# EAGLE design schematicv1.0 (EAGLE 9.6.2)
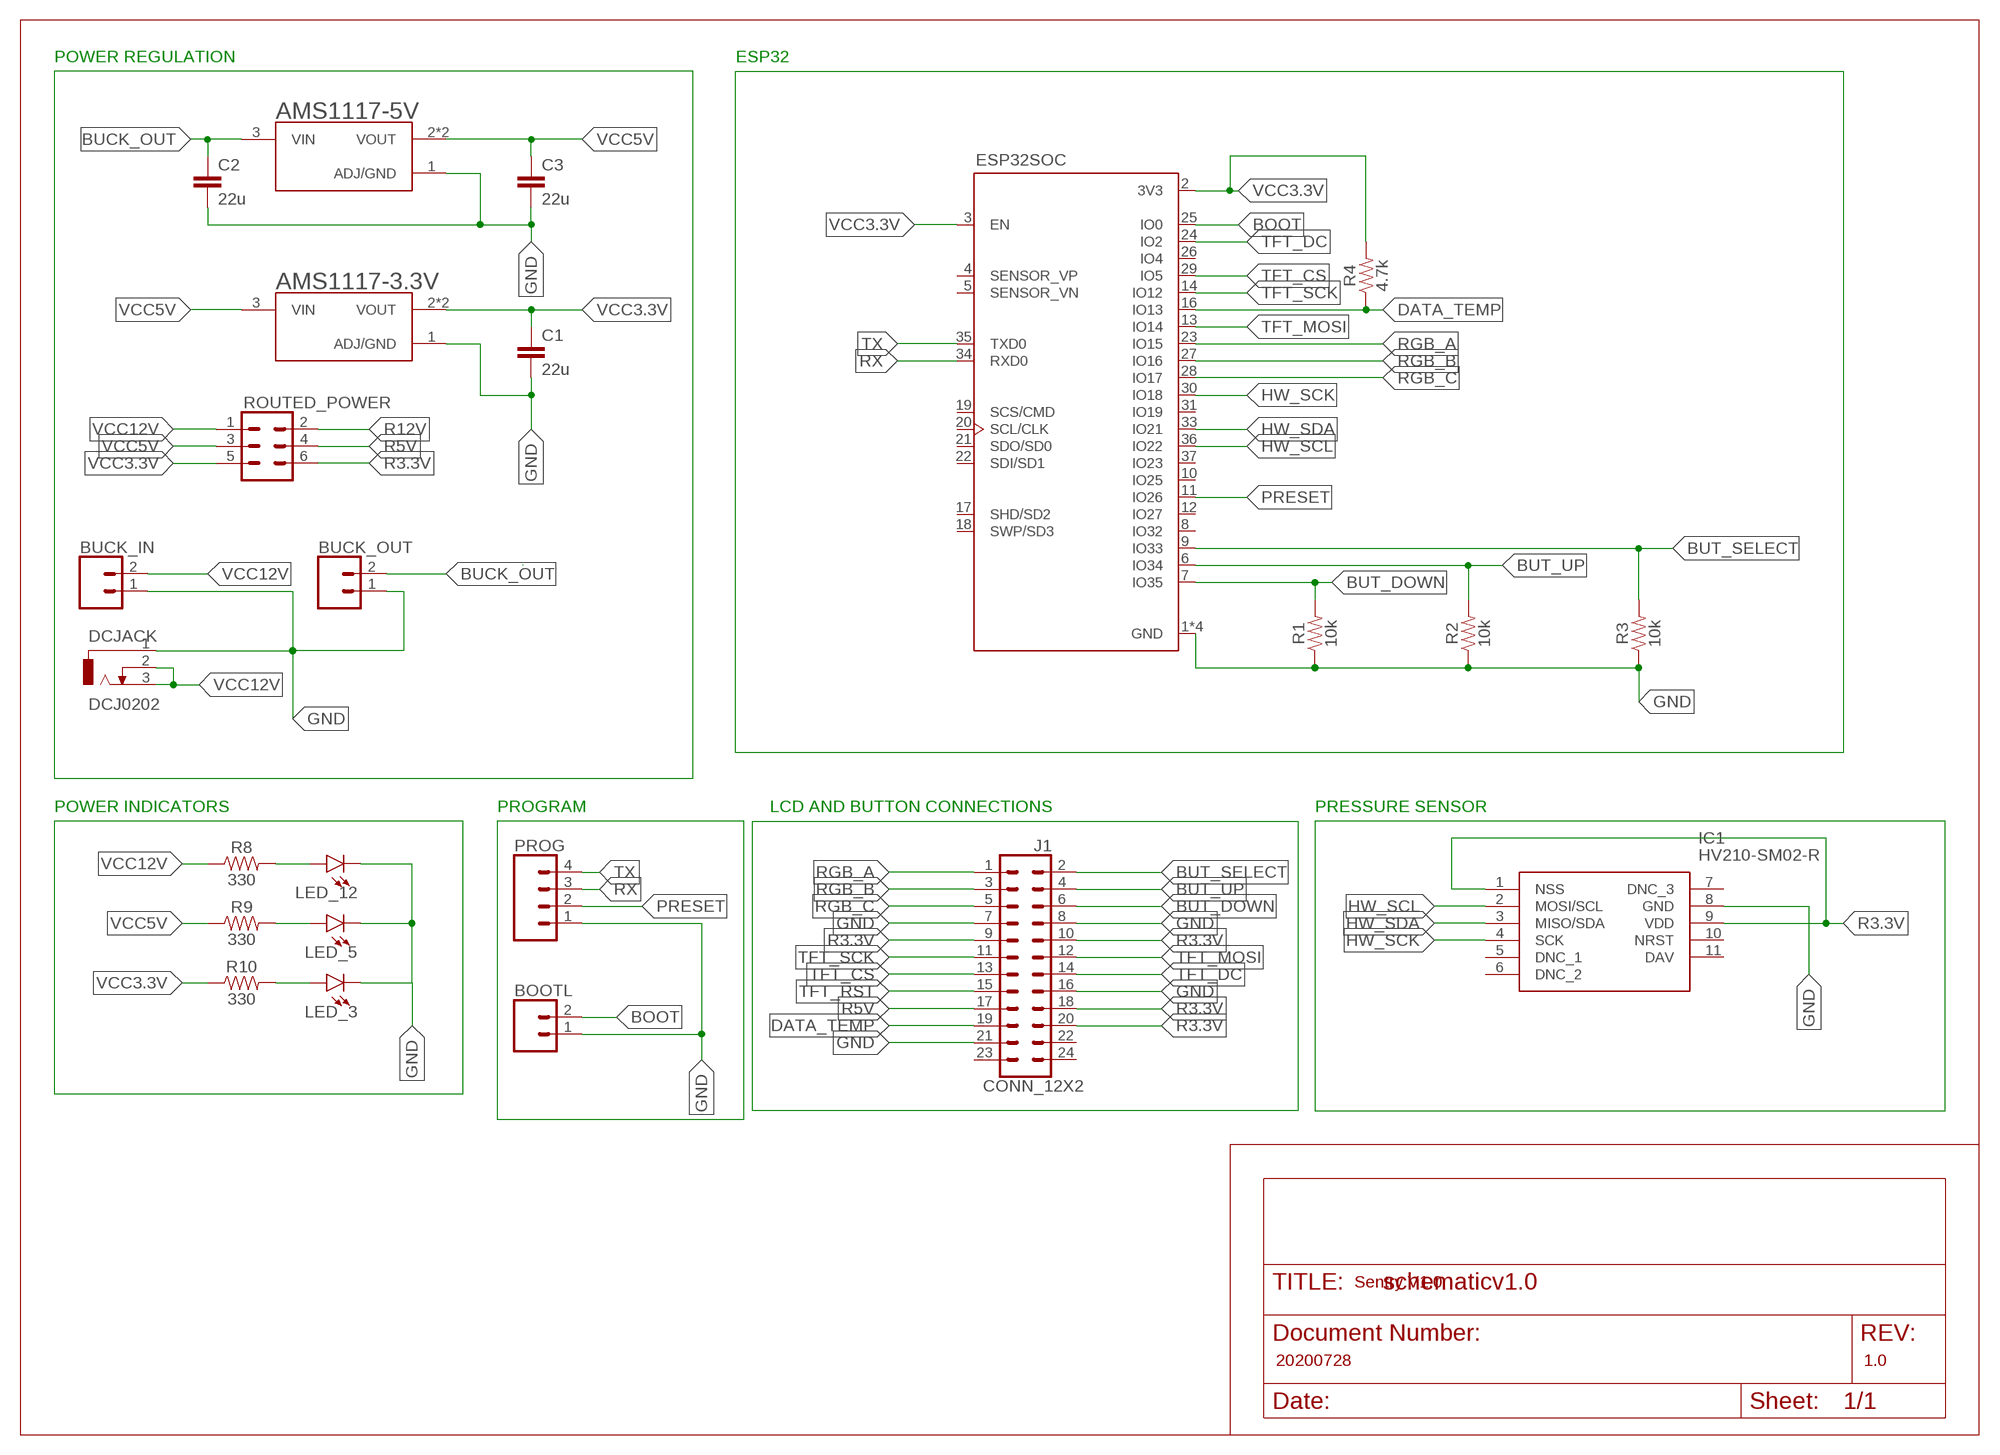
[diagram p0: schematic, sheet 1]

## Parts
AMS1117-3.3V  AMS1117  [SOT229P700X180-4N]
AMS1117-5V  AMS1117  [SOT229P700X180-4N]
BOOTL  CONN_02  [1X02]
BUCK_IN  CONN_02  [1X02]
BUCK_OUT  CONN_02  [1X02]
C1  22u  CAP-1206  [1206]
C2  22u  CAP-1206  [1206]
C3  22u  CAP-1206  [1206]
DCJACK  DCJ0202  [DCJ0202]
ESP32SOC  ESP32-WROOM-32D  [MODULE_ESP32-WROOM-32D]
IC1  HV210-SM02-R  [HV210SM02R]
J1  CONN_12X2  [2X12]
LED_3  LED1206  [LED-1206]
LED_5  LED1206  [LED-1206]
LED_12  LED1206  [LED-1206]
PROG  CONN_04PTH  [1X04]
R1  10k  RESISTOR1206  [1206]
R2  10k  RESISTOR1206  [1206]
R3  10k  RESISTOR1206  [1206]
R4  4.7k  RESISTOR1206  [1206]
R8  330  RESISTOR1206  [1206]
R9  330  RESISTOR1206  [1206]
R10  330  RESISTOR1206  [1206]
ROUTED_POWER  CONN_03X2FEMALE  [2X3]

## Nets
BOOT: BOOTL.2 ESP32SOC.25(IO0)
BUCK_OUT: AMS1117-5V.3(VIN) BUCK_OUT.2 C2.1
BUT_DOWN: ESP32SOC.7(IO35) J1.6 R1.2
BUT_SELECT: ESP32SOC.9(IO33) J1.2 R3.2
BUT_UP: ESP32SOC.6(IO34) J1.4 R2.2
DATA_TEMP: ESP32SOC.16(IO13) J1.19 R4.1
GND: AMS1117-3.3V.1(ADJ/GND) AMS1117-5V.1(ADJ/GND) BOOTL.1 BUCK_IN.1 BUCK_OUT.1 C1.2 C2.2 C3.2 DCJACK.1 ESP32SOC.1(GND) ESP32SOC.15(GND) ESP32SOC.38(GND) ESP32SOC.39(GND) IC1.8(GND) J1.7 J1.8 J1.16 J1.21 LED_3.C LED_5.C LED_12.C PROG.1 R1.1 R2.1 R3.1
HW_SCK: ESP32SOC.30(IO18) IC1.4(SCK)
HW_SCL: ESP32SOC.36(IO22) IC1.2(MOSI/SCL)
HW_SDA: ESP32SOC.33(IO21) IC1.3(MISO/SDA)
N$1: LED_12.A R8.2
N$2: LED_5.A R9.2
N$3: LED_3.A R10.2
PRESET: ESP32SOC.11(IO26) PROG.2
R3.3V: IC1.1(NSS) IC1.9(VDD) J1.9 J1.10 J1.18 J1.20 ROUTED_POWER.6
R5V: J1.17 ROUTED_POWER.4
R12V: ROUTED_POWER.2
RGB_A: ESP32SOC.23(IO15) J1.1
RGB_B: ESP32SOC.27(IO16) J1.3
RGB_C: ESP32SOC.28(IO17) J1.5
RX: ESP32SOC.34(RXD0) PROG.3
TFT_CS: ESP32SOC.29(IO5) J1.13
TFT_DC: ESP32SOC.24(IO2) J1.14
TFT_MOSI: ESP32SOC.13(IO14) J1.12
TFT_RST: J1.15
TFT_SCK: ESP32SOC.14(IO12) J1.11
TX: ESP32SOC.35(TXD0) PROG.4
VCC3.3V: AMS1117-3.3V.2(VOUT) AMS1117-3.3V.4(VOUT) C1.1 ESP32SOC.2(3V3) ESP32SOC.3(EN) R4.2 R10.1 ROUTED_POWER.5
VCC5V: AMS1117-3.3V.3(VIN) AMS1117-5V.2(VOUT) AMS1117-5V.4(VOUT) C3.1 R9.1 ROUTED_POWER.3
VCC12V: BUCK_IN.2 DCJACK.2 DCJACK.3 R8.1 ROUTED_POWER.1
Unconnected: ESP32SOC.4(SENSOR_VP) ESP32SOC.5(SENSOR_VN) ESP32SOC.8(IO32) ESP32SOC.10(IO25) ESP32SOC.12(IO27) ESP32SOC.17(SHD/SD2) ESP32SOC.18(SWP/SD3) ESP32SOC.19(SCS/CMD) ESP32SOC.20(SCL/CLK) ESP32SOC.21(SDO/SD0) ESP32SOC.22(SDI/SD1) ESP32SOC.26(IO4) ESP32SOC.31(IO19) ESP32SOC.37(IO23) IC1.5(DNC_1) IC1.6(DNC_2) IC1.7(DNC_3) IC1.10(NRST) IC1.11(DAV) J1.22 J1.23 J1.24

## Notes on the sheet
- POWER REGULATION | ESP32
- POWER INDICATORS | PROGRAM | LCD AND BUTTON CONNECTIONS | PRESSURE SENSOR
- Sentry V1.0
- 20200728 | 1.0

## Library data of the parts
AMS1117-3.3V AMS1117-5V = AMS1117:AMS1117: Sot223/Pkg 1-Amp 5-Volt Low Drop Out Voltage Regulatator; AVAILABILITY: Unavailable; DESCRIPTION: 1A LOW DROPOUT VOLTAGE REGULATOR; MF: Seeed Technology; MP: AMS1117; PACKAGE: SOT-223 Seeed Technology; PRICE: None
BOOTL BUCK_IN BUCK_OUT = SparkFun-Connectors:CONN_02: Multi connection point. Often used as Generic Header-pin footprint for 0.1 inch spaced/style header connections On any of the 0.1 inch spaced packages, you can populate with these: Break Away Headers - Straight <https://www.sparkfun.com/products/116> (PRT-00116) Break Away Male Headers - Right Angle <https://www.sparkfun.com/products/553> (PRT-00553) Female Headers <https://www.sparkfun.com/products/115> (PRT-00115) Break Away Headers - Machine Pin <https://www.sparkfun.com/products/117> (PRT-00117) Break Away Female Headers - Swiss Machine Pin <https://www.sparkfun.com/products/743> (PRT-00743) For SCREWTERMINALS and SPRING TERMINALS visit here: Screw Terimnals on SparkFun.com <https://www.sparkfun.com/search/results?term=Screw+Terminals> (5mm/3.5mm/2.54mm spacing) This device is also useful as a general connection point to wire up your design to another part of your project. Our various solder wires solder well into these plated through hole pads. Hook-Up Wire - Assortment (Stranded, 22 AWG) <https://www.sparkfun.com/products/11375> (PRT-11375) Hook-Up Wire - Assortment (Solid Core, 22 AWG) <https://www.sparkfun.com/products/11367> (PRT-11367) View the entire wire category on our website here <https://www.sparkfun.com/categories/141> Special notes: Molex polarized connector foot print use with: PRT-08233 with associated crimp pins and housings. 2.54_SCREWTERM for use with PRT-10571. 3.5mm Screw Terminal footprints for PRT-08084 5mm Screw Terminal footprints for use with PRT-08432
C1-C3 = SparkFun-Capacitors:CAP
DCJACK = con-jack:DCJ0202: DC POWER JACK Source: DCJ0202.pdf; OC_FARNELL: unknown; OC_NEWARK: unknown
ESP32SOC = ESP32-WROOM-32D:ESP32-WROOM-32D: IC: SoC; GPIO, I2C, I2S, IR, SD, SDIO, SPI, UART; 2.7÷3.6VDC; 20dBm; AVAILABILITY: Unavailable; DESCRIPTION: IC: SoC; GPIO, I2C, I2S, IR, SD, SDIO, SPI, UART; 2.7÷3.6VDC; 20dBm; MF: Espressif Systems; MP: ESP32-WROOM-32D; PACKAGE: Module Espressif Systems; PRICE: None
IC1 = HV210-SM02-R:HV210-SM02-R: Board Mount Pressure Sensors 10 inWC, Dual Die Source: Datasheet; DESCRIPTION: Board Mount Pressure Sensors 10 inWC, Dual Die; HEIGHT: 9.754mm; MANUFACTURER_NAME: Superior Sensor; MANUFACTURER_PART_NUMBER: HV210-SM02-R; MOUSER_PART_NUMBER: 211-HV210-SM02-R; MOUSER_PRICE-STOCK: https://www.mouser.co.uk/ProductDetail/Superior-Sensor/HV210-SM02-R?qs=vLWxofP3U2zWpu4kpA4tNA%3D%3D
J1 = SparkFun-Connectors:CONN_12X2: Multi connection point. Often used as Generic Header-pin footprint for 0.1 inch spaced/style header connections On any of the 0.1 inch spaced packages, you can populate with these: Break Away Headers - Straight <https://www.sparkfun.com/products/116> (PRT-00116) Break Away Male Headers - Right Angle <https://www.sparkfun.com/products/553> (PRT-00553) Female Headers <https://www.sparkfun.com/products/115> (PRT-00115) Break Away Headers - Machine Pin <https://www.sparkfun.com/products/117> (PRT-00117) Break Away Female Headers - Swiss Machine Pin <https://www.sparkfun.com/products/743> (PRT-00743)
LED_3 LED_5 LED_12 = SparkFun-LED:LED: LED (Generic) Standard schematic elements and footprints for 5mm, 3mm, 1206, and 0603 sized LEDs. Generic LEDs with no color specified.
PROG = SparkFun-Connectors:CONN_04: Multi connection point. Often used as Generic Header-pin footprint for 0.1 inch spaced/style header connections On any of the 0.1 inch spaced packages, you can populate with these: Break Away Headers - Straight <https://www.sparkfun.com/products/116> (PRT-00116) Break Away Male Headers - Right Angle <https://www.sparkfun.com/products/553> (PRT-00553) Female Headers <https://www.sparkfun.com/products/115> (PRT-00115) Break Away Headers - Machine Pin <https://www.sparkfun.com/products/117> (PRT-00117) Break Away Female Headers - Swiss Machine Pin <https://www.sparkfun.com/products/743> (PRT-00743) For SCREWTERMINALS and SPRING TERMINALS visit here: Screw Terimnals on SparkFun.com <https://www.sparkfun.com/search/results?term=Screw+Terminals> (5mm/3.5mm/2.54mm spacing) This device is also useful as a general connection point to wire up your design to another part of your project. Our various solder wires solder well into these plated through hole pads. Hook-Up Wire - Assortment (Stranded, 22 AWG) <https://www.sparkfun.com/products/11375> (PRT-11375) Hook-Up Wire - Assortment (Solid Core, 22 AWG) <https://www.sparkfun.com/products/11367> (PRT-11367) View the entire wire category on our website here <https://www.sparkfun.com/categories/141> Special notes: Molex polarized connector foot print use with SKU : PRT-08231 with associated crimp pins and housings. 1MM SMD Version SKU: PRT-10208; PROD_ID: CONN-09696
R1-R4 R8-R10 = SparkFun-Resistors:RESISTOR: Generic Resistor Package
ROUTED_POWER = SparkFun-Connectors:CONN_03X2: Multi connection point. Often used as Generic Header-pin footprint for 0.1 inch spaced/style header connections You can populate with any combo of single row headers, but if you'd like an exact match, check these: Header - 2x3 (Male, 0.1") <https://www.sparkfun.com/products/12807> (PRT-12807) Header - 2x3 (Female, 0.1") <https://www.sparkfun.com/products/13010> (PRT-13010) 2x3 Pin Shrouded Header <https://www.sparkfun.com/products/10877> (PRT-10877) On any of the 0.1 inch spaced packages, you can populate with these: Break Away Headers - Straight <https://www.sparkfun.com/products/116> (PRT-00116) Break Away Male Headers - Right Angle <https://www.sparkfun.com/products/553> (PRT-00553) Female Headers <https://www.sparkfun.com/products/115> (PRT-00115) Break Away Headers - Machine Pin <https://www.sparkfun.com/products/117> (PRT-00117) Break Away Female Headers - Swiss Machine Pin <https://www.sparkfun.com/products/743> (PRT-00743) Special note: the shrouded connector mates well with our 3x2 ribbon cables: Ribbon Crimp Connector - 6-pin (2x3, Female) <https://www.sparkfun.com/products/10651> (PRT-10651) Ribbon Cable - 6 wire (15ft) <https://www.sparkfun.com/products/10646> (PRT-10646); PROD_ID: CONN-11566; VALUE: FEMALE 2x3

## Board
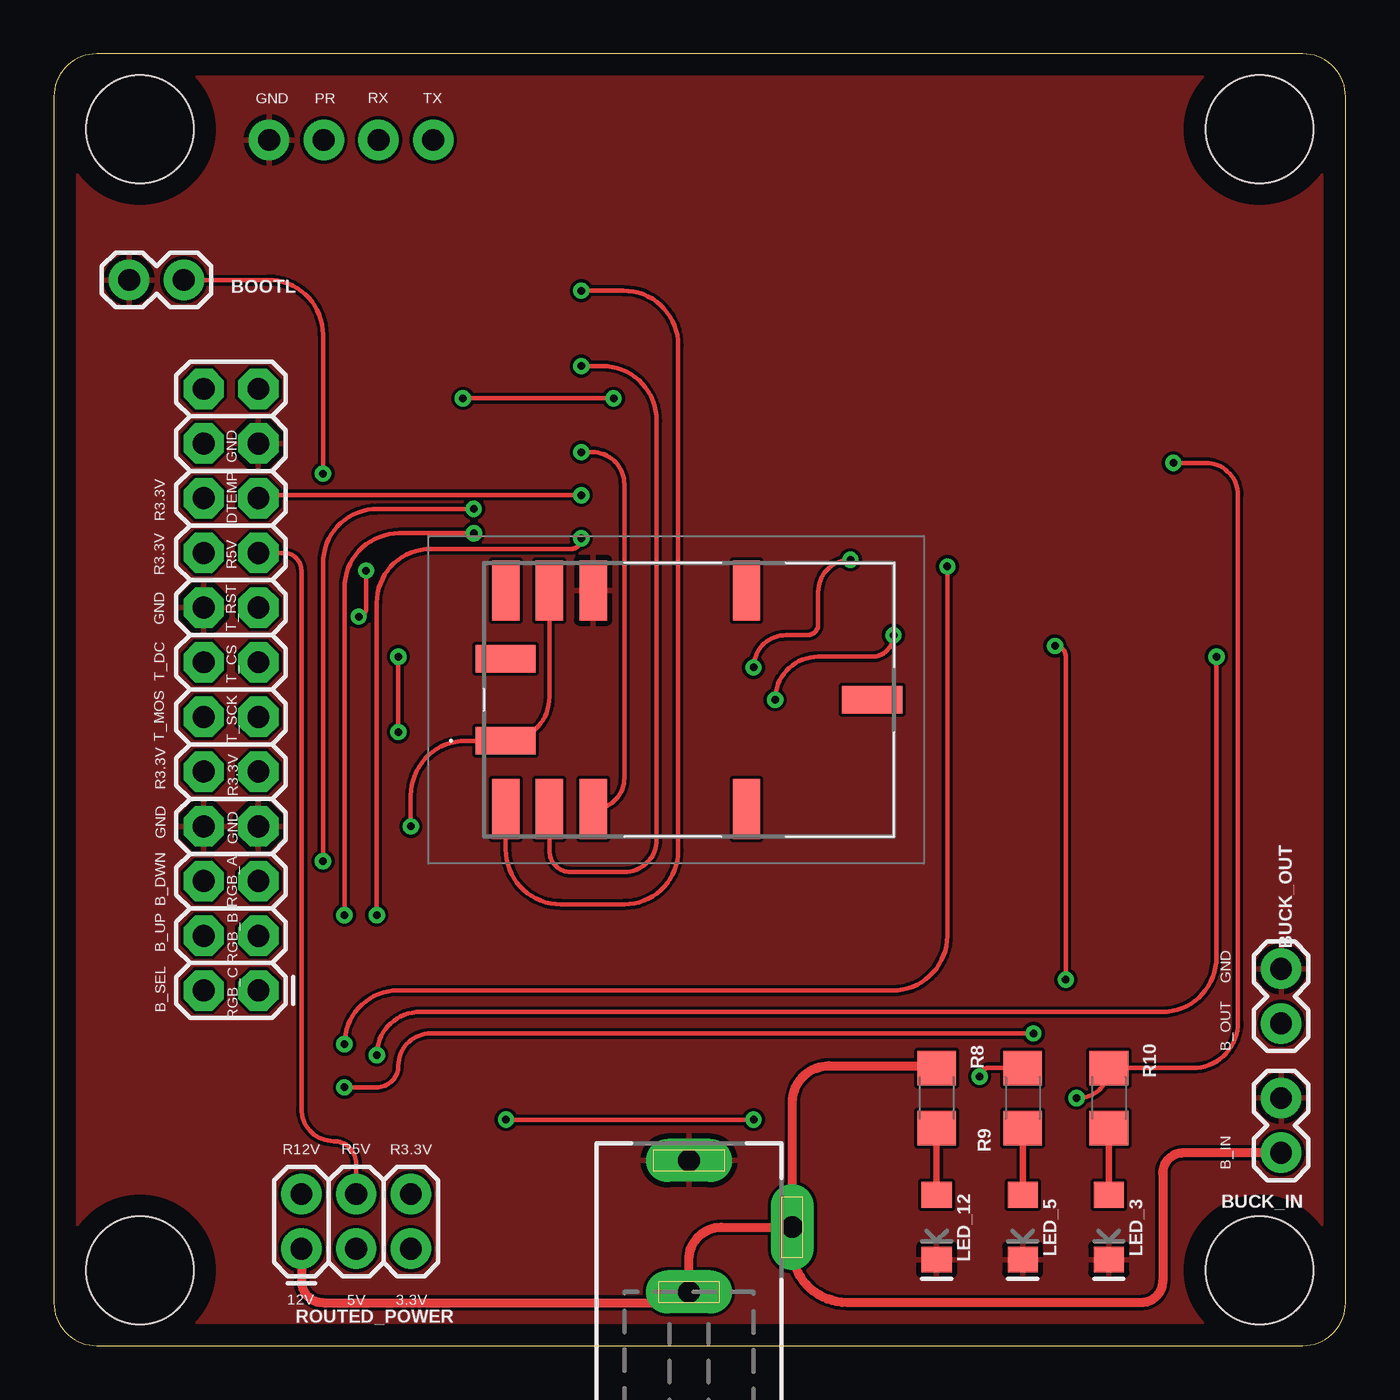
[diagram p1: board, top side]
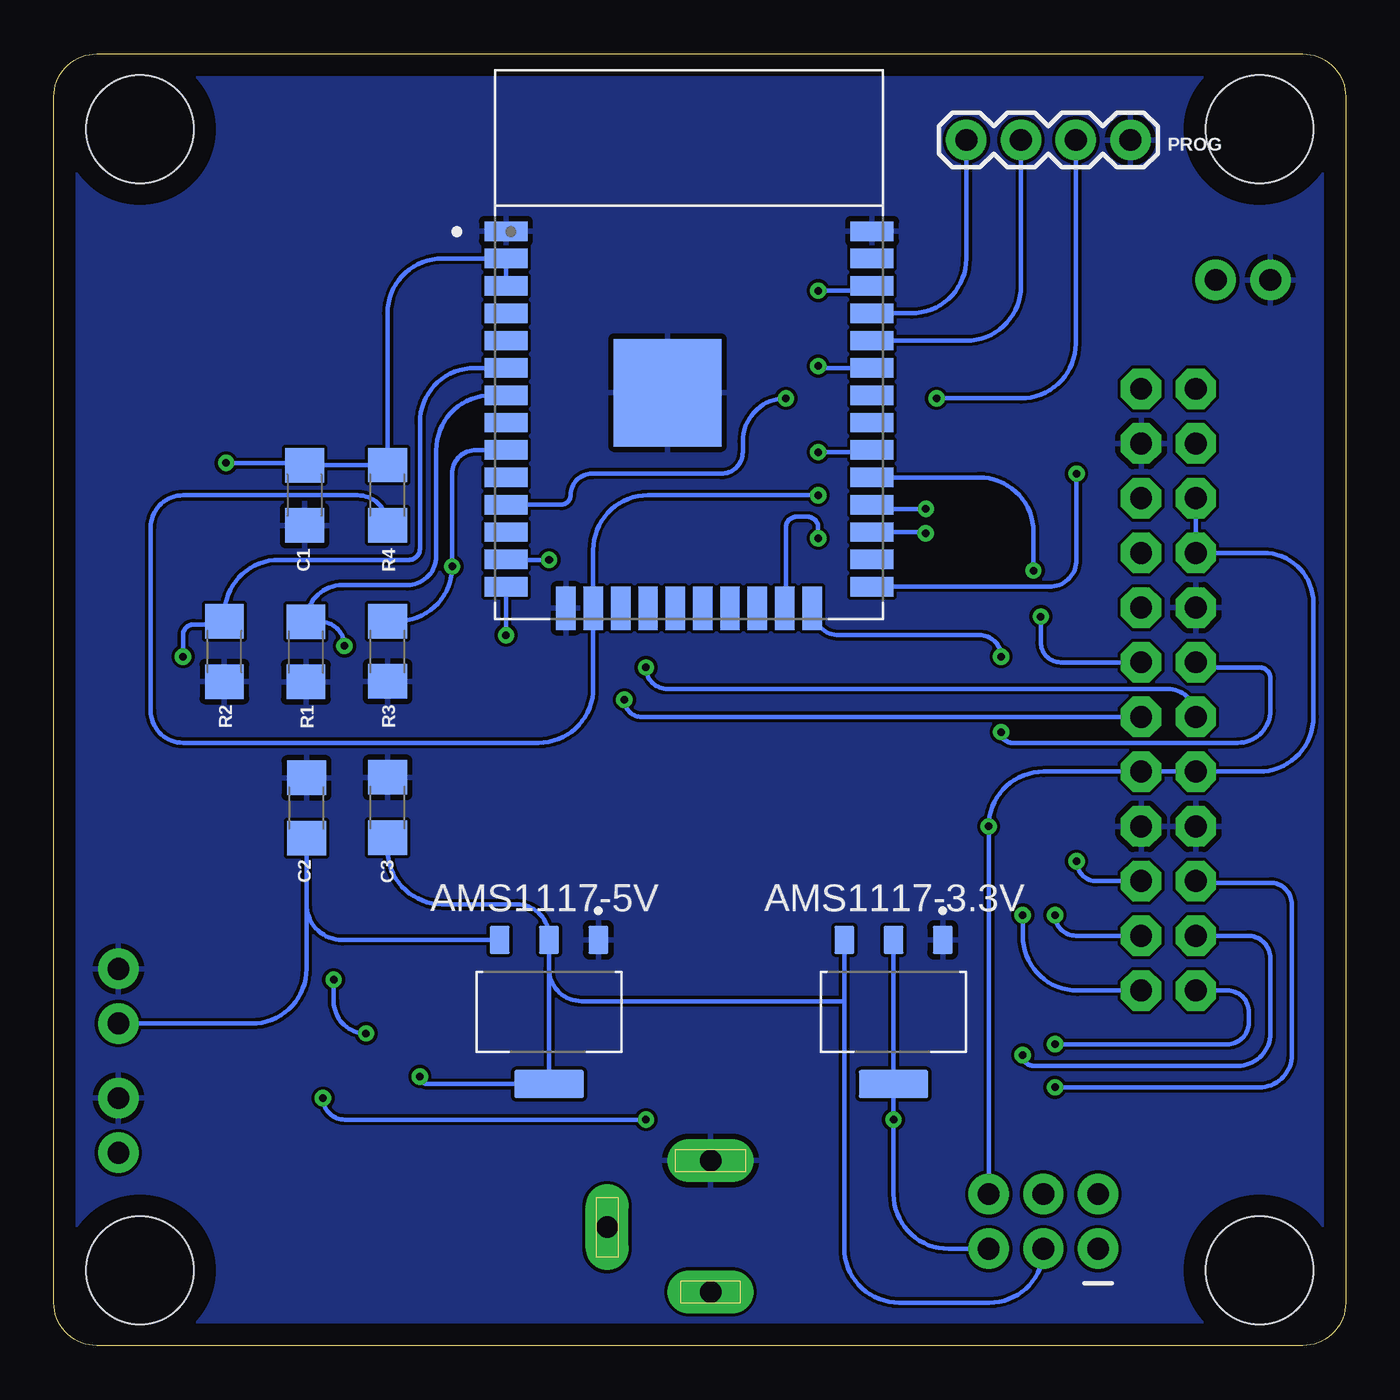
[diagram p2: board, bottom side, seen from below]

Size 60 x 60 mm. Coordinates in mm from the lower left corner, seen from the top.
Outline: 2,0 58,0 arc90 60,2 60,58 arc90 58,60 2,60 arc90 0,58 0,2 arc90 2,0
Copper layers (1*16): Top 0.035mm / dielectric 1.5mm / Bottom 0.035mm
Design rules "default": minimum track width 6mil, minimum drill 0.35mm, track to track 6mil, track to pad 6mil, pad to pad 6mil, via to via 6mil, smd to smd 6mil, copper to edge 40mil, drill to drill 6mil, minimum pad ring 10mil, minimum via ring 8mil, stop-mask expansion 4mil, vias tented up to drill 0mil, thermal gap 10mil
Holes 5 mm at 4,3.5 56,3.5 4,56.5 56,56.5

### Footprints (pad centres in the part's own frame; a part is rotated, then mirrored left to right if it is on the bottom)
SOT229P700X180-4N = smd 1.31 x 0.93: 1 -3.345,2.29; 2 -3.345,0; 3 -3.345,-2.29 | smd 1.31 x 3.24: 4 3.345,0
1X02 = drill 1.016 pad 1.88: 1 0,0; 2 2.54,0
1206 = smd 1.6 x 1.8: 1 -1.4,0; 2 1.4,0
DCJ0202 = drill 1 pad 2 long: 1 0,3.1; 2 4.8,0; 3 0,-3
MODULE_ESP32-WROOM-32D = smd 2 x 0.9: 1 -8.5,5.26; 2 -8.5,3.99; 3 -8.5,2.72; 4 -8.5,1.45; 5 -8.5,0.18; 6 -8.5,-1.09; 7 -8.5,-2.36; 8 -8.5,-3.63; 9 -8.5,-4.9; 10 -8.5,-6.17; 11 -8.5,-7.44; 12 -8.5,-8.71; 13 -8.5,-9.98; 14 -8.5,-11.25; 25 8.5,-11.25; 26 8.5,-9.98; 27 8.5,-8.71; 28 8.5,-7.44; 29 8.5,-6.17; 30 8.5,-4.9; 31 8.5,-3.63; 32 8.5,-2.36; 33 8.5,-1.09; 34 8.5,0.18; 35 8.5,1.45; 36 8.5,2.72; 37 8.5,3.99; 38 8.5,5.26 | smd 0.9 x 2: 15 -5.715,-12.25; 16 -4.445,-12.25; 17 -3.175,-12.25; 18 -1.905,-12.25; 19 -0.635,-12.25; 20 0.635,-12.25; 21 1.905,-12.25; 22 3.175,-12.25; 23 4.445,-12.25; 24 5.715,-12.25 | smd 5 x 5: 39 -1,-2.24
HV210SM02R = smd 2.79 x 1.27: 1 8.51,1.91; 6 -8.51,0; 11 8.51,-1.91 | smd 1.27 x 2.79: 2 8.51,5.08; 3 6.48,5.08; 4 4.45,5.08; 5 -2.67,5.08; 7 -2.67,-5.08; 8 4.45,-5.08; 9 6.48,-5.08; 10 8.51,-5.08
2X12 = drill 1.016 pad 1.88 octagon: 1 0,0; 2 0,2.54; 3 2.54,0; 4 2.54,2.54; 5 5.08,0; 6 5.08,2.54; 7 7.62,0; 8 7.62,2.54; 9 10.16,0; 10 10.16,2.54; 11 12.7,0; 12 12.7,2.54; 13 15.24,0; 14 15.24,2.54; 15 17.78,0; 16 17.78,2.54; 17 20.32,0; 18 20.32,2.54; 19 22.86,0; 20 22.86,2.54; 21 25.4,0; 22 25.4,2.54; 23 27.94,0; 24 27.94,2.54
LED-1206 = smd 1.2 x 1.4: A -1.5,0; C 1.5,0
1X04 = drill 1.016 pad 1.88: 1 0,0; 2 2.54,0; 3 5.08,0; 4 7.62,0
2X3 = drill 1.016 pad 1.88: 1 0,0; 2 0,2.54; 3 2.54,0; 4 2.54,2.54; 5 5.08,0; 6 5.08,2.54

### Placement (x,y rotation side)
AMS1117-3.3V  21,15.5 270 bottom
AMS1117-5V  37,15.5 270 bottom
BOOTL  3.5,49.5 0 top
BUCK_IN  57,11.5 270 top
BUCK_OUT  57,17.5 270 top
C1  48.35,39.5 270 bottom
C2  48.26,24.97 90 bottom
C3  44.5,25 90 bottom
DCJACK  29.5,5.5 0 top
ESP32SOC  30.5,46.5 0 bottom
IC1  29.5,30 180 top
J1  9.5,16.5 90 top
LED_3  49,5.5 270 top
LED_5  45,5.5 270 top
LED_12  41,5.5 270 top
PROG  10,56 180 bottom
R1  48.29,32.23 90 bottom
R2  52.08,32.24 90 bottom
R3  44.5,32.25 90 bottom
R4  44.5,39.5 90 bottom
R8  41,11.5 270 top
R9  45,11.5 270 top
R10  49,11.5 270 top
ROUTED_POWER  11.5,4.5 0 top

### Tracks (layer width: path | path; a pad name or v marks a point on that pad's centre or on a via)
BOOT  (via drill 0.35)
  Top 0.203: BOOTL.2 9.96,49.5 arc-90 12.5,46.96 v12.5,40.5
  Bottom 0.203: v12.5,40.5 12.5,36.5 arc90 13.75,35.25 ESP32SOC.25
BUCK_OUT
  Bottom 0.203: BUCK_OUT.2 50.8,14.96 arc-90 48.26,17.5 48.26,20.5 | 48.26,20.5 C2.1 | AMS1117-5V.3 46.61,18.84 arc90 48.26,20.5
BUT_DOWN  (via drill 0.35)
  Top 0.203: v13.5,12 15,12 arc90 16,13 arc-90 17.5,14.5 v45.5,14.5 | v47,17 47,32 arc90 v46.5,32.5
  Bottom 0.203: ESP32SOC.7 39.7,44.14 arc-90 42.24,41.6 42.24,36.67 arc90 43.58,35.32 46.59,35.32 arc-90 R1.2 47.63,33.63 arc90 v46.5,32.5 | 6.88,21.5 arc90 J1.6 arc-90 6.88,21.5 | 6.88,21.5 3.5,21.5 arc90 2.5,20.5 2.5,13.5 arc90 4,12 v13.5,12 | v45.5,14.5 arc90 47,16 v47,17
BUT_SELECT  (via drill 0.35)
  Top 0.203: v13.5,14 arc-90 16,16.5 38.96,16.5 arc90 41.5,19.04 v41.5,36.19
  Bottom 0.203: R3.2 44.04,33.65 arc-90 v41.5,36.19 41.5,40.5 arc90 40.4,41.6 ESP32SOC.9 | J1.2 5.5,16.5 arc90 4.5,15.5 4.5,15 arc90 5.5,14 v13.5,14
BUT_UP  (via drill 0.35)
  Top 0.203: v15,13.5 arc-90 17,15.5 51.46,15.5 arc90 54,18.04 v54,32
  Bottom 0.203: ESP32SOC.6 40.46,45.41 arc-90 43,42.87 43,37 arc90 43.5,36.5 49.54,36.5 arc-90 52.08,33.96 R2.2 arc90 52.22,33.5 53.5,33.5 arc-90 54,33 v54,32 | J1.4 4.54,19.04 arc90 3.5,18 3.5,14.5 arc90 5,13 14.5,13 arc90 v15,13.5
DATA_TEMP  (via drill 0.35)
  Top 0.203: v24.5,39.5 9.64,39.5 arc90 J1.19
  Bottom 0.203: R4.1 arc-90 45.9,39.5 54,39.5 arc-90 55.5,38 55.5,29.5 arc-90 54,28 37.48,28 arc-90 34.95,30.54 ESP32SOC.16 34.95,36.96 arc90 32.41,39.5 v24.5,39.5
GND
  pour Top: -1,61 60,61 63,58 63,0.5 58.5,-4 3,-4 -3,2 -3,59
  pour Bottom: -2,61.5 60,61.5 62.5,59 62.5,1.5 58.5,-2.5 0,-2.5 -4,1.5 -4,59.5
HW_SCK  (via drill 0.35)
  Top 0.203: IC1.4 arc90 26.5,26.37 26.5,40 arc90 25,41.5 v24.5,41.5
  Bottom 0.203: v24.5,41.5 22.1,41.5 arc-90 ESP32SOC.30
HW_SCL  (via drill 0.35)
  Top 0.203: IC1.2 20.99,23.04 arc90 23.53,20.5 26.5,20.5 arc90 29,23 29,46.46 arc90 26.46,49 v24.5,49
  Bottom 0.203: v24.5,49 22.22,49 arc-90 ESP32SOC.36
HW_SDA  (via drill 0.35)
  Top 0.203: IC1.3 23.02,22.98 arc90 24,22 26.5,22 arc90 28,23.5 28,42.96 arc90 25.46,45.5 v24.5,45.5
  Bottom 0.203: v24.5,45.5 arc-90 24.41,45.41 ESP32SOC.33
N$1
  Top 0.305: R8.2 LED_12.A
N$2
  Top 0.305: R9.2 LED_5.A
N$3
  Top 0.305: R10.2 LED_3.A
PRESET  (via drill 0.35)
  Top 0.203: v19,44 v26,44
  Bottom 0.203: PROG.2 12.54,46.54 arc90 15.08,44 v19,44 | v26,44 arc-90 28,42 28,41.5 arc90 29,40.5 35,40.5 arc-90 36,39.5 arc90 36.44,39.06 ESP32SOC.11
R3.3V  (via drill 0.35)
  Top 0.203: IC1.9 23.02,30.12 arc-90 IC1.1 19.12,28.09 arc90 16.58,25.55 v16.58,24.12
  Bottom 0.203: ROUTED_POWER.6 v16.58,24.12 arc90 14.04,26.66 J1.9 J1.10 4.04,26.66 arc-90 1.5,29.2 1.5,34.5 arc-90 3.82,36.82 J1.18 J1.20
R5V
  Top 0.203: J1.17 10.68,36.82 arc-90 11.5,36 11.5,11 arc90 13,9.5 arc-90 14.04,8.46 ROUTED_POWER.4
RGB_A  (via drill 0.35)
  Top 0.203: v15,20 15,34.5 arc-90 17.5,37 24,37 arc90 v24.5,37.5
  Bottom 0.203: J1.1 12.46,16.5 arc90 15,19.04 v15,20 | v24.5,37.5 24.5,38 arc-90 25,38.5 25.5,38.5 arc-90 26,38 26,34.3 arc90 ESP32SOC.23
RGB_B  (via drill 0.35)
  Top 0.203: v19.5,37.73 16.04,37.73 arc90 13.5,35.19 v13.5,20
  Bottom 0.203: ESP32SOC.27 19.56,37.79 arc90 v19.5,37.73 | J1.3 12.54,19.04 arc90 v13.5,20
RGB_C  (via drill 0.35)
  Top 0.203: v19.5,38.87 15.04,38.87 arc90 12.5,36.33 v12.5,22.5
  Bottom 0.203: ESP32SOC.28 arc-90 21.81,38.87 v19.5,38.87 | J1.5 11.58,21.58 arc90 v12.5,22.5
RX
  Bottom 0.203: PROG.3 15.08,49.22 arc90 17.62,46.68 ESP32SOC.34
TFT_CS  (via drill 0.35)
  Top 0.203: v14.5,36 14.5,34.2 arc-90 v14.16,33.86
  Bottom 0.203: ESP32SOC.29 17.04,40.33 arc90 14.5,37.79 v14.5,36 | J1.13 13.24,31.74 arc90 14.16,32.66 v14.16,33.86
TFT_DC  (via drill 0.35)
  Top 0.203: v16,32 v16,28.5
  Bottom 0.203: ESP32SOC.24 arc-90 23.54,33 17,33 arc90 v16,32 | v16,28.5 arc-90 15.5,28 5,28 arc-90 3.5,29.5 3.5,31 arc-90 4,31.5 6.72,31.5 arc90 J1.14
TFT_MOSI  (via drill 0.35)
  Top 0.203: v32.5,31.5 arc-90 34,33 35,33 arc90 35.5,33.5 35.5,35 arc-90 v37,36.5
  Bottom 0.203: J1.12 arc-90 8.26,30.5 31.5,30.5 arc90 v32.5,31.5 | ESP32SOC.13 arc-90 38.98,36.5 v37,36.5
TFT_SCK  (via drill 0.35)
  Top 0.203: v33.5,30 arc-90 35.5,32 38,32 arc90 v39,33
  Bottom 0.203: J1.11 32.7,29.2 arc90 v33.5,30 | v39,33 ESP32SOC.14
TX
  Bottom 0.203: PROG.4 17.62,50.49 arc90 20.16,47.95 ESP32SOC.35
VCC3.3V  (via drill 0.35)
  Top 0.203: v47.5,11.5 47.6,11.5 arc90 R10.1 52.9,12.9 arc90 55,15 55,39.5 arc90 53.5,41 v52,41 | v21,10.5 v32.5,10.5
  Bottom 0.203: AMS1117-3.3V.2 AMS1117-3.3V.4 v21,10.5 21,7.04 arc-90 18.46,4.5 ROUTED_POWER.5 | 48,40.9 R4.2 44.5,47.95 arc90 41.96,50.49 ESP32SOC.2 ESP32SOC.3 | 48,40.9 C1.1 arc-90 C1.1 | v32.5,10.5 46.5,10.5 arc90 v47.5,11.5 | 48,40.9 arc-90 48.1,41 v52,41
VCC5V  (via drill 0.35)
  Top 0.203: R9.1 43.4,12.9 arc90 v43,12.5
  Bottom 0.203: 37,17.5 AMS1117-5V.2 37,19 arc-90 38.5,20.5 41.96,20.5 arc90 44.5,23.04 C3.1 | 37,17.5 AMS1117-5V.4 42.66,12.15 arc90 v43,12.5 | ROUTED_POWER.3 arc90 16.54,2 20.75,2 arc90 23.29,4.54 23.29,16 | 23.29,16 AMS1117-3.3V.3 | 23.29,16 35.5,16 arc90 37,17.5
VCC12V
  Top 0.406: DCJACK.2 34,5.5 31,5.5 arc90 29.5,4 DCJACK.3 arc-90 29,2 12.5,2 arc-90 11.5,3 ROUTED_POWER.1 | DCJACK.2 34.3,11.3 arc-90 36,13 40.9,13 arc-90 R8.1 | BUCK_IN.2 54.04,8.96 52.46,8.96 arc90 51.5,8 51.5,3 arc-90 50.5,2 36.84,2 arc-90 34.3,4.54 DCJACK.2

### Text on the board
tNames: GND | PR | RX | TX | GND | R3.3V | DTEMP | R3.3V | R5V | GND | T_RST | T_DC | T_CS | T_MOS | T_SCK | R3.3V | R3.3V | GND | GND | B_DWN | RGB_A | B_UP | RGB_B | GND | B_SEL | RGB_C | B_OUT | R12V | R5V | R3.3V | B_IN | 12V | 5V | 3.3V